# EAGLE design gameboy (EAGLE 9.5.2)
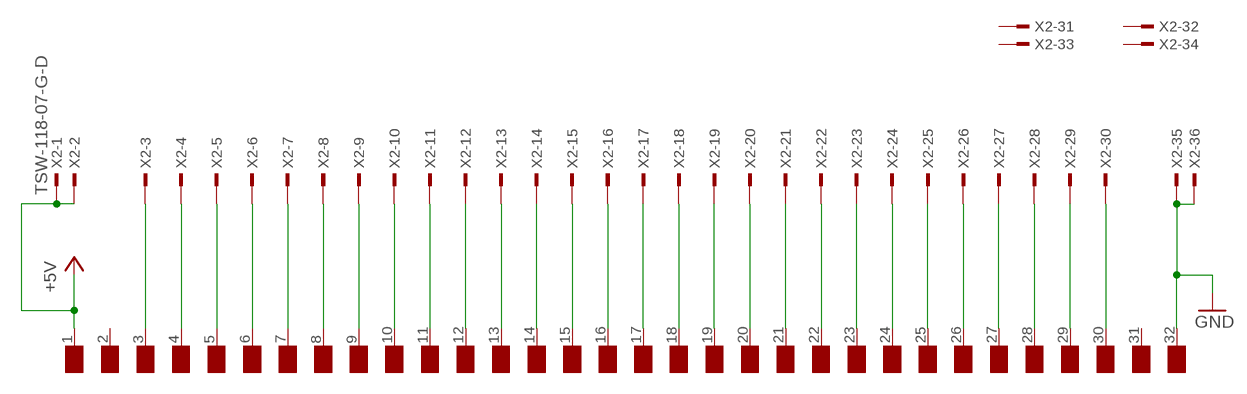
[diagram p0: schematic, sheet 1]

## Parts
U$1  CONNECTOR  [CONNECTOR]
X2  TSW-118-07-G-D  [TSW-118-XX-G-D]

## Nets
+5V: U$1.1(VDD) X2.1 X2.2
GND: U$1.32(GND) X2.35 X2.36
N$1: U$1.3(/WR) X2.3
N$2: U$1.4(/RD) X2.4
N$3: U$1.5(/RCS) X2.5
N$4: U$1.6(A0) X2.6
N$5: U$1.7(A1) X2.7
N$6: U$1.8(A2) X2.8
N$7: U$1.9(A3) X2.9
N$8: U$1.10(A4) X2.10
N$9: U$1.11(A5) X2.11
N$10: U$1.12(A6) X2.12
N$11: U$1.13(A7) X2.13
N$12: U$1.14(A8) X2.14
N$13: U$1.15(A9) X2.15
N$14: U$1.16(A10) X2.16
N$15: U$1.17(A11) X2.17
N$16: U$1.18(A12) X2.18
N$17: U$1.19(A13) X2.19
N$18: U$1.20(A14) X2.20
N$19: U$1.21(A15) X2.21
N$20: U$1.22(D0) X2.22
N$21: U$1.23(D1) X2.23
N$22: U$1.24(D2) X2.24
N$23: U$1.25(D3) X2.25
N$24: U$1.26(D4) X2.26
N$25: U$1.27(D5) X2.27
N$26: U$1.28(D6) X2.28
N$27: U$1.29(D7) X2.29
N$28: U$1.30(/RS) X2.30
Unconnected: U$1.2(NC) U$1.31(VIN) X2.31 X2.32 X2.33 X2.34

## Library data of the parts
U$1 = gameboy:CONNECTOR: Connector Pads for Gameboy Cartridges
X2 = con-samtec:TSW-118-*-G: THROUGH-HOLE .025" SQ POST HEADER Source: Samtec TSW.pdf; MF: Samtec Inc.; MPN: TSW-118-07-G-D

## Board
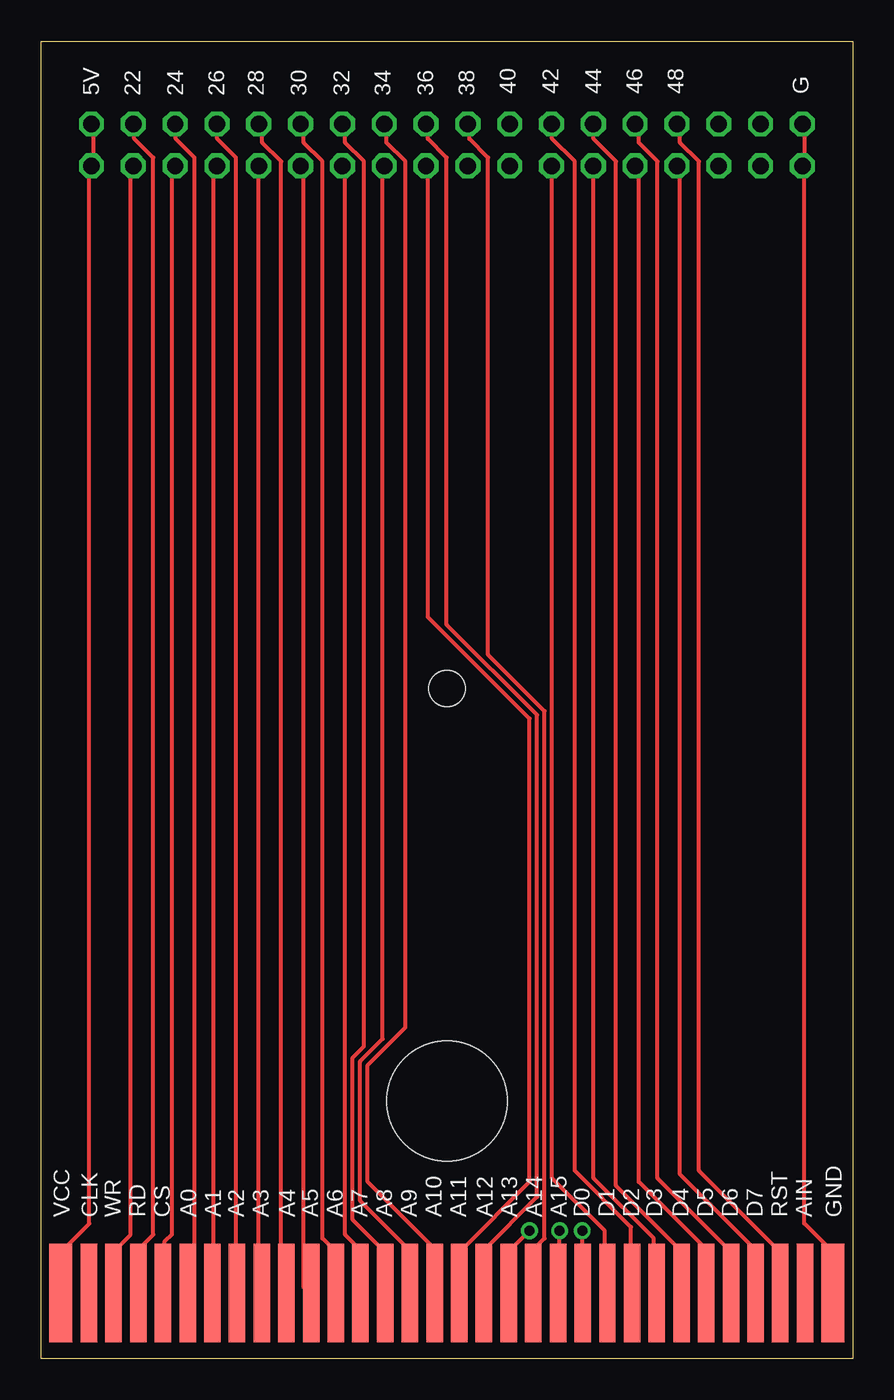
[diagram p1: board, top side]
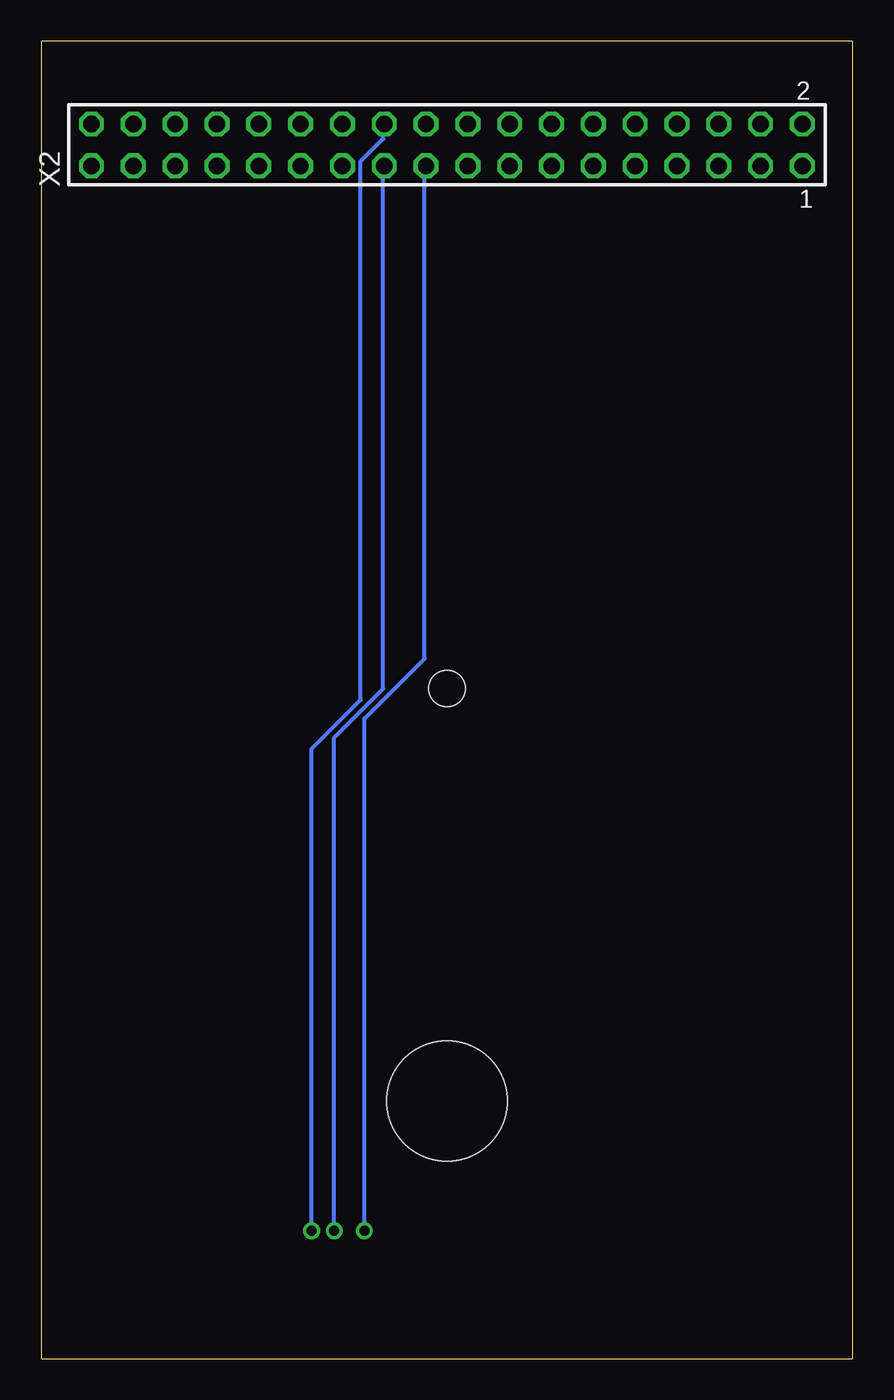
[diagram p2: board, bottom side, seen from below]

Size 49.3 x 80 mm. Coordinates in mm from the lower left corner, seen from the top.
Outline: 0,80 49.3,80 49.3,0 0,0 0,80
Copper layers (1*16): Top 0.035mm / dielectric 1.5mm / Bottom 0.035mm
Design rules "default": minimum track width 10mil, minimum drill 24mil, track to track 8mil, track to pad 8mil, pad to pad 8mil, via to via 8mil, smd to smd 8mil, copper to edge 40mil, drill to drill 8mil, minimum pad ring 10mil, minimum via ring 8mil, stop-mask expansion 4mil, vias tented up to drill 0mil, thermal gap 10mil
Holes 7.3 mm at 24.65,15.65
Holes 2.2 mm at 24.65,40.7

### Footprints (pad centres in the part's own frame; a part is rotated, then mirrored left to right if it is on the bottom)
CONNECTOR = smd 1.4 x 6: 1 0.7,-3; 32 47.6,-3 | smd 1 x 6: 2 2.4,-3; 3 3.9,-3; 4 5.4,-3; 5 6.9,-3; 6 8.4,-3; 7 9.9,-3; 8 11.4,-3; 9 12.9,-3; 10 14.4,-3; 11 15.9,-3; 12 17.4,-3; 13 18.9,-3; 14 20.4,-3; 15 21.9,-3; 16 23.4,-3; 17 24.9,-3; 18 26.4,-3; 19 27.9,-3; 20 29.4,-3; 21 30.9,-3; 22 32.4,-3; 23 33.9,-3; 24 35.4,-3; 25 36.9,-3; 26 38.4,-3; 27 39.9,-3; 28 41.4,-3; 29 42.9,-3; 30 44.4,-3; 31 45.9,-3
TSW-118-XX-G-D = drill 1 pad 1.5 octagon: 1 21.59,-1.27; 2 21.59,1.27; 3 19.05,-1.27; 4 19.05,1.27; 5 16.51,-1.27; 6 16.51,1.27; 7 13.97,-1.27; 8 13.97,1.27; 9 11.43,-1.27; 10 11.43,1.27; 11 8.89,-1.27; 12 8.89,1.27; 13 6.35,-1.27; 14 6.35,1.27; 15 3.81,-1.27; 16 3.81,1.27; 17 1.27,-1.27; 18 1.27,1.27; 19 -1.27,-1.27; 20 -1.27,1.27; 21 -3.81,-1.27; 22 -3.81,1.27; 23 -6.35,-1.27; 24 -6.35,1.27; 25 -8.89,-1.27; 26 -8.89,1.27; 27 -11.43,-1.27; 28 -11.43,1.27; 29 -13.97,-1.27; 30 -13.97,1.27; 31 -16.51,-1.27; 32 -16.51,1.27; 33 -19.05,-1.27; 34 -19.05,1.27; 35 -21.59,-1.27; 36 -21.59,1.27

### Placement (x,y rotation side)
U$1  0.5,7 0 top
X2  24.65,73.7 0 bottom

### Tracks (layer width: path | path; a pad name or v marks a point on that pad's centre or on a via)
+5V
  Top 0.254: X2.2 3.15,74.75 3.15,72.47 X2.1 2.92,72.24 2.92,8.2 1.32,6.6 1.32,4.12 U$1.1
GND
  Top 0.254: X2.36 46.36,74.75 46.36,72.47 X2.35 46.36,72.24 46.36,8.23 47.96,6.63 47.96,4.12 U$1.32
N$1
  Top 0.254: X2.3 5.44,72.24 5.44,7.54 4.52,6.63 4.52,4.12 U$1.3
N$2
  Top 0.254: X2.4 5.67,74.75 5.67,74.07 6.81,72.92 6.81,7.54 6.12,6.86 6.12,4.12 U$1.4
N$3
  Top 0.254: U$1.5 7.48,4.08 7.48,7.1 7.95,7.57 7.95,72.24 X2.5
N$4
  Top 0.254: X2.6 8.18,74.75 8.18,74.07 9.32,72.92 9.32,4.34 9.09,4.12 U$1.6
N$5
  Top 0.254: X2.7 10.47,72.24 10.47,4.12 U$1.7
N$6
  Top 0.254: X2.8 10.69,74.75 10.69,74.07 11.84,72.92 11.84,4.12 U$1.8
N$7
  Top 0.254: X2.9 13.21,72.24 13.21,4.12 U$1.9
N$8
  Top 0.254: X2.10 13.44,74.75 13.44,73.84 14.58,72.69 14.58,4.34 14.81,4.12 U$1.10
N$9
  Top 0.254: X2.11 15.95,72.24 15.95,4.34 16.18,4.12 U$1.11
N$10
  Top 0.254: X2.12 15.95,74.75 15.95,73.84 17.09,72.69 17.09,7.32 17.78,6.63 17.78,4.12 U$1.12
N$11
  Top 0.254: X2.13 18.47,72.24 18.47,7.54 19.38,6.63 19.38,4.12 U$1.13
N$12
  Top 0.254: X2.14 18.47,74.75 18.47,73.84 19.61,72.69 19.61,18.97 18.92,18.29 18.92,8.46 20.75,6.63 20.75,4.12 U$1.14
N$13
  Top 0.254: X2.15 20.75,72.24 20.75,19.43 19.38,18.06 19.38,9.6 22.35,6.63 22.35,4.12 U$1.15
N$14
  Top 0.254: X2.16 20.98,74.75 20.98,73.84 22.12,72.69 22.12,20.12 19.84,17.83 19.84,10.74 23.72,6.86 23.72,4.12 U$1.16
N$15
  Top 0.254: X2.17 23.5,72.24 23.5,45.03 29.67,38.86 29.67,10.74 25.55,6.63 25.55,4.12 U$1.17
N$16
  Top 0.254: X2.18 23.5,74.75 23.5,74.07 24.64,72.92 24.64,44.58 30.12,39.09 30.12,9.83 26.93,6.63 26.93,4.12 U$1.18
N$17  (via drill 0.61)
  Top 0.254: v29.67,7.77 28.52,6.63 28.52,4.12 U$1.19
  Bottom 0.254: v29.67,7.77 29.67,38.86 26.01,42.52 26.01,72.24 X2.19
N$18
  Top 0.254: X2.20 26.01,74.75 26.01,74.07 27.15,72.92 27.15,42.75 30.58,39.32 30.58,7.32 30.12,6.86 30.12,4.12 U$1.20
N$19  (via drill 0.61)
  Top 0.254: v31.5,7.77 31.5,4.12 U$1.21
  Bottom 0.254: v31.5,7.77 31.5,37.72 28.52,40.69 28.52,72.24 X2.21
N$20  (via drill 0.61)
  Top 0.254: v32.87,7.77 32.87,4.12 U$1.22
  Bottom 0.254: v32.87,7.77 32.87,37.03 29.9,40.01 29.9,72.69 28.52,74.07 28.52,74.75 X2.22
N$21
  Top 0.254: X2.23 31.04,72.24 31.04,10.97 34.24,7.77 34.24,4.12 U$1.23
N$22
  Top 0.254: X2.24 31.04,74.75 31.04,74.07 32.41,72.69 32.41,11.43 35.84,8 35.84,4.12 U$1.24
N$23
  Top 0.254: X2.25 33.55,72.24 33.55,10.97 37.21,7.32 37.21,4.12 U$1.25
N$24
  Top 0.254: X2.26 33.55,74.75 33.55,74.07 34.93,72.69 34.93,10.52 38.81,6.63 38.81,4.12 U$1.26
N$25
  Top 0.254: X2.27 36.3,72.24 36.3,10.74 40.18,6.86 40.18,4.12 U$1.27
N$26
  Top 0.254: X2.28 36.3,74.75 36.3,73.84 37.44,72.69 37.44,10.97 41.78,6.63 41.78,4.12 U$1.28
N$27
  Top 0.254: X2.29 38.81,72.24 38.81,11.2 43.38,6.63 43.38,4.12 U$1.29
N$28
  Top 0.254: X2.30 38.81,74.75 38.81,73.84 39.96,72.69 39.96,11.43 44.76,6.63 44.76,4.12 U$1.30

### Text on the board
tNames: 5V | 22 | 24 | 26 | 28 | 30 | 32 | 34 | 36 | 38 | 40 | 42 | 44 | 46 | 48 | G | VCC | CLK | WR | RD | CS | A0 | A1 | A2 | A3 | A4 | A5 | A6 | A7 | A8 | A9 | A10 | A11 | A12 | A13 | A14 | A15 | D0 | D1 | D2 | D3 | D4 | D5 | D6 | D7 | RST | AIN | GND